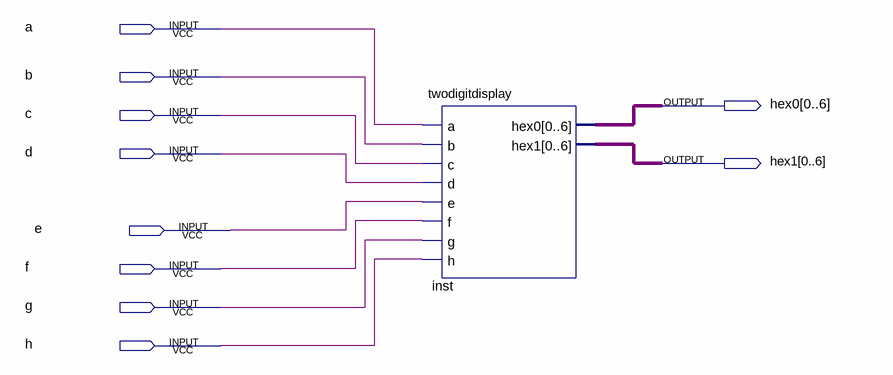
[diagram p0: schematic sheet]
// Quartus schematic Lab4A.bdf as structural Verilog: 1 symbols, 10 pins
module Lab4A (
  input  a,
  input  b,
  input  c,
  input  d,
  input  e,
  input  f,
  input  g,
  input  h,
  output [0:6] hex0,
  output [0:6] hex1
);

  twodigitdisplay inst (.a(a), .b(b), .c(c), .d(d), .e(e), .f(f), .g(g), .h(h), .hex0(hex0), .hex1(hex1));
endmodule
